# EAGLE schematic Thunderbread (EAGLE 7.6.0)
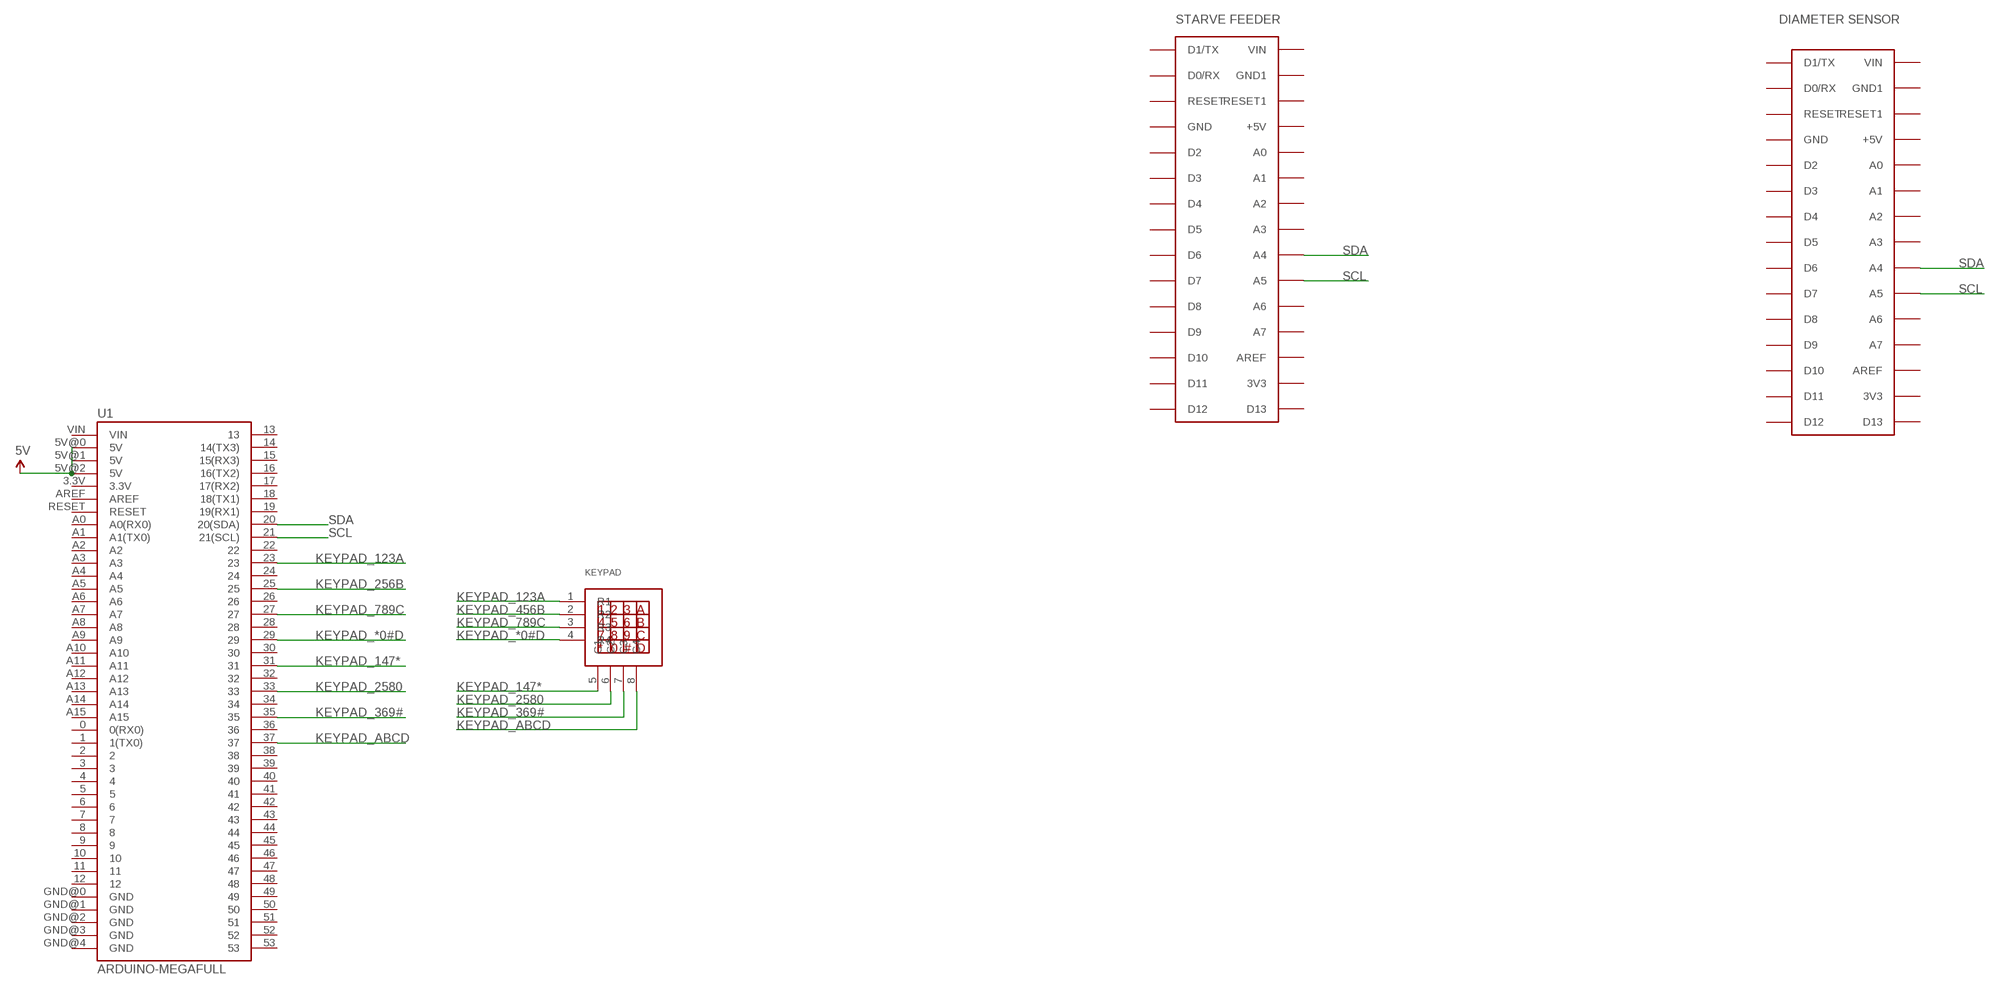
[diagram p0: schematic, sheet 1]

## Parts
KEYPAD  KEYPAD4X4  [KEYPAD4X4]
U1  ARDUINO-MEGAFULL  [ARDUINO_MEGA]
U$1  ARDUINONANO  [PDIP-32]
U$2  ARDUINONANO  [PDIP-32]

## Nets
5V: U1.5V@0(5V) U1.5V@2(5V)
KEYPAD_123A: KEYPAD.1(R1) U1.23
KEYPAD_147*: KEYPAD.5(C1) U1.31
KEYPAD_256B: U1.25
KEYPAD_369#: KEYPAD.7(C3) U1.35
KEYPAD_456B: KEYPAD.2(R2)
KEYPAD_789C: KEYPAD.3(R3) U1.27
KEYPAD_2580: KEYPAD.6(C2) U1.33
KEYPAD_*0#D: KEYPAD.4(R4) U1.29
KEYPAD_ABCD: KEYPAD.8(C4) U1.37
SCL: U1.21(21(SCL)) U$1.A5 U$2.A5
SDA: U1.20(20(SDA)) U$1.A4 U$2.A4
Unconnected: U1.0(0(RX0)) U1.1(1(TX0)) U1.2 U1.3 U1.3.3V U1.4 U1.5 U1.5V@1(5V) U1.6 U1.7 U1.8 U1.9 U1.10 U1.11 U1.12 U1.13 U1.14(14(TX3)) U1.15(15(RX3)) U1.16(16(TX2)) U1.17(17(RX2)) U1.18(18(TX1)) U1.19(19(RX1)) U1.22 U1.24 U1.26 U1.28 U1.30 U1.32 U1.34 U1.36 U1.38 U1.39 U1.40 U1.41 U1.42 U1.43 U1.44 U1.45 U1.46 U1.47 U1.48 U1.49 U1.50 U1.51 U1.52 U1.53 U1.A0(A0(RX0)) U1.A1(A1(TX0)) U1.A2 U1.A3 U1.A4 U1.A5 U1.A6 U1.A7 U1.A8 U1.A9 U1.A10 U1.A11 U1.A12 U1.A13 U1.A14 U1.A15 U1.AREF U1.GND@0(GND) U1.GND@1(GND) U1.GND@2(GND) U1.GND@3(GND) U1.GND@4(GND) U1.RESET U1.VIN U$1.3V3 U$1.+5V U$1.A0 U$1.A1 U$1.A2 U$1.A3 U$1.A6 U$1.A7 U$1.AREF U$1.D0/RX U$1.D1/TX U$1.D2 U$1.D3 U$1.D4 U$1.D5 U$1.D6 U$1.D7 U$1.D8 U$1.D9 U$1.D10 U$1.D11 U$1.D12 U$1.D13 U$1.GND U$1.GND1 U$1.RESET U$1.RESET1 U$1.VIN U$2.3V3 U$2.+5V U$2.A0 U$2.A1 U$2.A2 U$2.A3 U$2.A6 U$2.A7 U$2.AREF U$2.D0/RX U$2.D1/TX U$2.D2 U$2.D3 U$2.D4 U$2.D5 U$2.D6 U$2.D7 U$2.D8 U$2.D9 U$2.D10 U$2.D11 U$2.D12 U$2.D13 U$2.GND U$2.GND1 U$2.RESET U$2.RESET1 U$2.VIN

## Notes on the sheet
- STARVE FEEDER | DIAMETER SENSOR

## Library data of the parts
KEYPAD = keypad4x4_ece:KEYPAD4X4
U1 = SparkFun-Boards:ARDUINO-MEGA: Arduino Mega board footprint
U$1 U$2 = jet-lib:ARDUINONANO